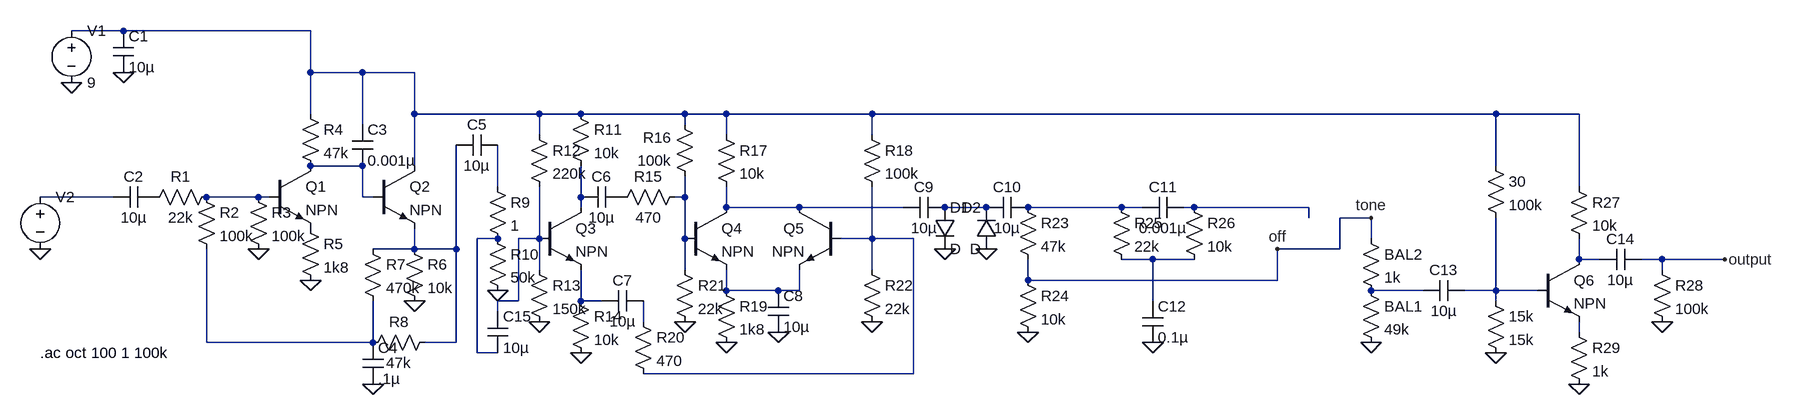
[diagram p0: schematic univox superfuzz.asc]
univox superfuzz.asc, the LTspice schematic file:
Version 4
SHEET 1 2472 704
WIRE -80 144 -160 144
WIRE 208 144 -80 144
WIRE 208 208 208 144
WIRE 288 208 208 208
WIRE 368 208 288 208
WIRE 208 272 208 208
WIRE 368 272 368 208
WIRE 560 272 368 272
WIRE 624 272 560 272
WIRE 784 272 624 272
WIRE 848 272 784 272
WIRE 1072 272 848 272
WIRE 2032 272 1072 272
WIRE 2160 272 2032 272
WIRE 288 288 288 208
WIRE 784 288 784 272
WIRE 560 304 560 272
WIRE 848 304 848 272
WIRE 1072 304 1072 272
WIRE 288 352 208 352
WIRE 368 352 368 272
WIRE 2032 352 2032 272
WIRE 496 384 496 320
WIRE 2160 384 2160 272
WIRE -96 400 -208 400
WIRE 128 400 48 400
WIRE 144 400 128 400
WIRE 288 400 288 352
WIRE 304 400 288 400
WIRE 624 400 624 352
WIRE 784 400 784 368
WIRE 784 400 768 400
WIRE 624 416 624 400
WIRE 848 416 848 384
WIRE 960 416 848 416
WIRE 1120 416 960 416
WIRE 1248 416 1184 416
WIRE 1456 416 1312 416
WIRE 1488 416 1456 416
WIRE 1568 416 1552 416
WIRE 1728 416 1568 416
WIRE 1744 416 1728 416
WIRE 1744 432 1744 416
WIRE 1840 432 1792 432
WIRE 496 464 464 464
WIRE 560 464 560 384
WIRE 560 464 528 464
WIRE 784 464 784 400
WIRE 1072 464 1072 384
WIRE 1072 464 1024 464
WIRE 1136 464 1072 464
WIRE 1840 464 1840 432
WIRE 368 480 368 448
WIRE 368 480 304 480
WIRE 432 480 432 320
WIRE 432 480 368 480
WIRE 1792 480 1792 432
WIRE 1792 480 1696 480
WIRE 1504 496 1456 496
WIRE 1568 496 1504 496
WIRE 2160 496 2160 464
WIRE 2192 496 2160 496
WIRE 2288 496 2256 496
WIRE 2384 496 2288 496
WIRE 560 512 560 464
WIRE 784 512 784 464
WIRE 1072 512 1072 464
WIRE 2288 512 2288 496
WIRE 1312 528 1312 496
WIRE 1696 528 1696 480
WIRE 1696 528 1312 528
WIRE 848 544 848 512
WIRE 928 544 848 544
WIRE 960 544 960 512
WIRE 960 544 928 544
WIRE 1920 544 1840 544
WIRE 2032 544 2032 432
WIRE 2032 544 1984 544
WIRE 2096 544 2032 544
WIRE 528 560 528 464
WIRE 528 560 496 560
WIRE 624 560 624 512
WIRE 656 560 624 560
WIRE 1504 560 1504 496
WIRE 2032 560 2032 544
WIRE 496 576 496 560
WIRE 720 592 720 560
WIRE 2160 608 2160 592
WIRE 48 624 48 480
WIRE 304 624 304 560
WIRE 304 624 48 624
WIRE 432 624 432 480
WIRE 432 624 384 624
WIRE 464 640 464 464
WIRE 496 640 464 640
WIRE 1136 672 1136 464
WIRE 1136 672 720 672
FLAG -160 224 0
FLAG -208 480 0
FLAG 208 528 0
FLAG 128 480 0
FLAG -80 208 0
FLAG 368 560 0
FLAG 304 688 0
FLAG 496 544 0
FLAG 560 592 0
FLAG 624 640 0
FLAG 784 592 0
FLAG 848 624 0
FLAG 1072 592 0
FLAG 1504 624 0
FLAG 1312 608 0
FLAG 1248 480 0
FLAG 1184 480 0
FLAG 2288 592 0
FLAG 2160 688 0
FLAG 2032 640 0
FLAG 1840 624 0
FLAG 928 608 0
FLAG 2384 496 output
FLAG 1840 432 tone
FLAG 1696 480 off
SYMBOL voltage -160 128 R0
SYMATTR InstName V1
SYMATTR Value 9
SYMBOL voltage -208 384 R0
SYMATTR InstName V2
SYMATTR Value ""
SYMATTR Value2 AC 1
SYMBOL cap -96 144 R0
SYMATTR InstName C1
SYMATTR Value 10µ
SYMBOL res 64 384 R90
WINDOW 0 0 56 VBottom 2
WINDOW 3 32 56 VTop 2
SYMATTR InstName R1
SYMATTR Value 22k
SYMBOL cap -32 384 R90
WINDOW 0 0 32 VBottom 2
WINDOW 3 32 32 VTop 2
SYMATTR InstName C2
SYMATTR Value 10µ
SYMBOL res 32 384 R0
SYMATTR InstName R2
SYMATTR Value 100k
SYMBOL res 112 384 R0
SYMATTR InstName R3
SYMATTR Value 100k
SYMBOL res 192 256 R0
SYMATTR InstName R4
SYMATTR Value 47k
SYMBOL npn 144 352 R0
SYMATTR InstName Q1
SYMBOL res 192 432 R0
SYMATTR InstName R5
SYMATTR Value 1k8
SYMBOL cap 272 288 R0
SYMATTR InstName C3
SYMATTR Value 0.001µ
SYMBOL npn 304 352 R0
SYMATTR InstName Q2
SYMBOL res 352 464 R0
SYMATTR InstName R6
SYMATTR Value 10k
SYMBOL res 288 464 R0
SYMATTR InstName R7
SYMATTR Value 470k
SYMBOL res 400 608 R90
WINDOW 0 0 56 VBottom 2
WINDOW 3 32 56 VTop 2
SYMATTR InstName R8
SYMATTR Value 47k
SYMBOL cap 288 624 R0
SYMATTR InstName C4
SYMATTR Value .1µ
SYMBOL cap 496 304 R90
WINDOW 0 0 32 VBottom 2
WINDOW 3 32 32 VTop 2
SYMATTR InstName C5
SYMATTR Value 10µ
SYMBOL res 480 368 R0
SYMATTR InstName R9
SYMATTR Value 1
SYMBOL res 480 448 R0
SYMATTR InstName R10
SYMATTR Value 50k
SYMBOL res 608 256 R0
SYMATTR InstName R11
SYMATTR Value 10k
SYMBOL npn 560 416 R0
SYMATTR InstName Q3
SYMBOL res 544 288 R0
SYMATTR InstName R12
SYMATTR Value 220k
SYMBOL res 544 496 R0
SYMATTR InstName R13
SYMATTR Value 150k
SYMBOL cap 688 384 R90
WINDOW 0 0 32 VBottom 2
WINDOW 3 32 32 VTop 2
SYMATTR InstName C6
SYMATTR Value 10µ
SYMBOL cap 720 544 R90
WINDOW 0 0 32 VBottom 2
WINDOW 3 32 32 VTop 2
SYMATTR InstName C7
SYMATTR Value 10µ
SYMBOL res 608 544 R0
SYMATTR InstName R14
SYMATTR Value 10k
SYMBOL res 784 384 R90
WINDOW 0 0 56 VBottom 2
WINDOW 3 32 56 VTop 2
SYMATTR InstName R15
SYMATTR Value 470
SYMBOL res 800 384 R180
WINDOW 0 36 76 Left 2
WINDOW 3 36 40 Left 2
SYMATTR InstName R16
SYMATTR Value 100k
SYMBOL npn 784 416 R0
SYMATTR InstName Q4
SYMBOL npn 1024 416 M0
SYMATTR InstName Q5
SYMBOL res 832 288 R0
SYMATTR InstName R17
SYMATTR Value 10k
SYMBOL res 1056 288 R0
SYMATTR InstName R18
SYMATTR Value 100k
SYMBOL res 832 528 R0
SYMATTR InstName R19
SYMATTR Value 1k8
SYMBOL res 704 576 R0
SYMATTR InstName R20
SYMATTR Value 470
SYMBOL res 768 496 R0
SYMATTR InstName R21
SYMATTR Value 22k
SYMBOL res 1056 496 R0
SYMATTR InstName R22
SYMATTR Value 22k
SYMBOL cap 912 544 R0
SYMATTR InstName C8
SYMATTR Value 10µ
SYMBOL cap 1184 400 R90
WINDOW 0 0 32 VBottom 2
WINDOW 3 32 32 VTop 2
SYMATTR InstName C9
SYMATTR Value 10µ
SYMBOL diode 1168 416 R0
SYMATTR InstName D1
SYMBOL diode 1264 480 R180
WINDOW 0 24 64 Left 2
WINDOW 3 24 0 Left 2
SYMATTR InstName D2
SYMBOL cap 1312 400 R90
WINDOW 0 0 32 VBottom 2
WINDOW 3 32 32 VTop 2
SYMATTR InstName C10
SYMATTR Value 10µ
SYMBOL res 1296 400 R0
SYMATTR InstName R23
SYMATTR Value 47k
SYMBOL res 1296 512 R0
SYMATTR InstName R24
SYMATTR Value 10k
SYMBOL res 1440 400 R0
SYMATTR InstName R25
SYMATTR Value 22k
SYMBOL res 1552 400 R0
SYMATTR InstName R26
SYMATTR Value 10k
SYMBOL cap 1552 400 R90
WINDOW 0 0 32 VBottom 2
WINDOW 3 32 32 VTop 2
SYMATTR InstName C11
SYMATTR Value 0.001µ
SYMBOL cap 1488 560 R0
SYMATTR InstName C12
SYMATTR Value 0.1µ
SYMBOL res 1824 448 R0
SYMATTR InstName BAL2
SYMATTR Value 1k
SYMBOL res 1824 528 R0
SYMATTR InstName BAL1
SYMATTR Value 49k
SYMBOL res 2016 544 R0
SYMATTR InstName 15k
SYMATTR Value 15k
SYMBOL res 2016 336 R0
SYMATTR InstName 30
SYMATTR Value 100k
SYMBOL cap 1984 528 R90
WINDOW 0 0 32 VBottom 2
WINDOW 3 32 32 VTop 2
SYMATTR InstName C13
SYMATTR Value 10µ
SYMBOL npn 2096 496 R0
SYMATTR InstName Q6
SYMBOL res 2144 368 R0
SYMATTR InstName R27
SYMATTR Value 10k
SYMBOL res 2272 496 R0
SYMATTR InstName R28
SYMATTR Value 100k
SYMBOL res 2144 592 R0
SYMATTR InstName R29
SYMATTR Value 1k
SYMBOL cap 2256 480 R90
WINDOW 0 0 32 VBottom 2
WINDOW 3 32 32 VTop 2
SYMATTR InstName C14
SYMATTR Value 10µ
SYMBOL cap 480 576 R0
SYMATTR InstName C15
SYMATTR Value 10µ
TEXT -208 640 Left 2 !.ac oct 100 1 100k

The netlist it stands for:
* univox superfuzz.asc
V1 N001 0 9
V2 N004 0 AC 1
C1 N001 0 10µ
R1 N005 P001 22k
C2 P001 N004 10µ
R2 N005 N024 100k
R3 N005 0 100k
R4 N001 N002 47k
Q1 N002 N005 P002 0 NPN
R5 P002 0 1k8
C3 N001 N002 0.001µ
Q2 N001 N002 N015 0 NPN
R6 N015 0 10k
R7 N015 N024 470k
R8 N015 N024 47k
C4 N024 0 .1µ
C5 N003 N015 10µ
R9 N003 N012 1
R10 N012 0 50k
R11 N001 N006 10k
Q3 N006 N013 N021 0 NPN
R12 N001 N013 220k
R13 N013 0 150k
C6 P003 N006 10µ
C7 N022 N021 10µ
R14 N021 0 10k
R15 N007 P003 470
R16 N007 N001 100k
Q4 N008 N007 N018 0 NPN
Q5 N008 N014 N018 0 NPN
R17 N001 N008 10k
R18 N001 N014 100k
R19 N018 0 1k8
R20 N022 N014 470
R21 N007 0 22k
R22 N014 0 22k
C8 N018 0 10µ
C9 N009 N008 10µ
D1 N009 0 D
D2 0 N009 D
C10 N010 N009 10µ
R23 N010 off 47k
R24 off 0 10k
R25 N010 N016 22k
R26 N011 N016 10k
C11 N011 N010 0.001µ
C12 N016 0 0.1µ
R§BAL2 off N019 1k
R§BAL1 N019 0 49k
R§15k N020 0 15k
R§30 N001 N020 100k
C13 N020 N019 10µ
Q6 N017 N020 N023 0 NPN
R27 N001 N017 10k
R28 output 0 100k
R29 N023 0 1k
C14 output N017 10µ
C15 N013 N012 10µ
.model D D
.lib standard.dio
.model NPN NPN
.model PNP PNP
.lib standard.bjt
.ac oct 100 1 100k
.backanno
.end